# EAGLE board ARE_adaptadores_v101 (EAGLE 6.1), part 1 of 2
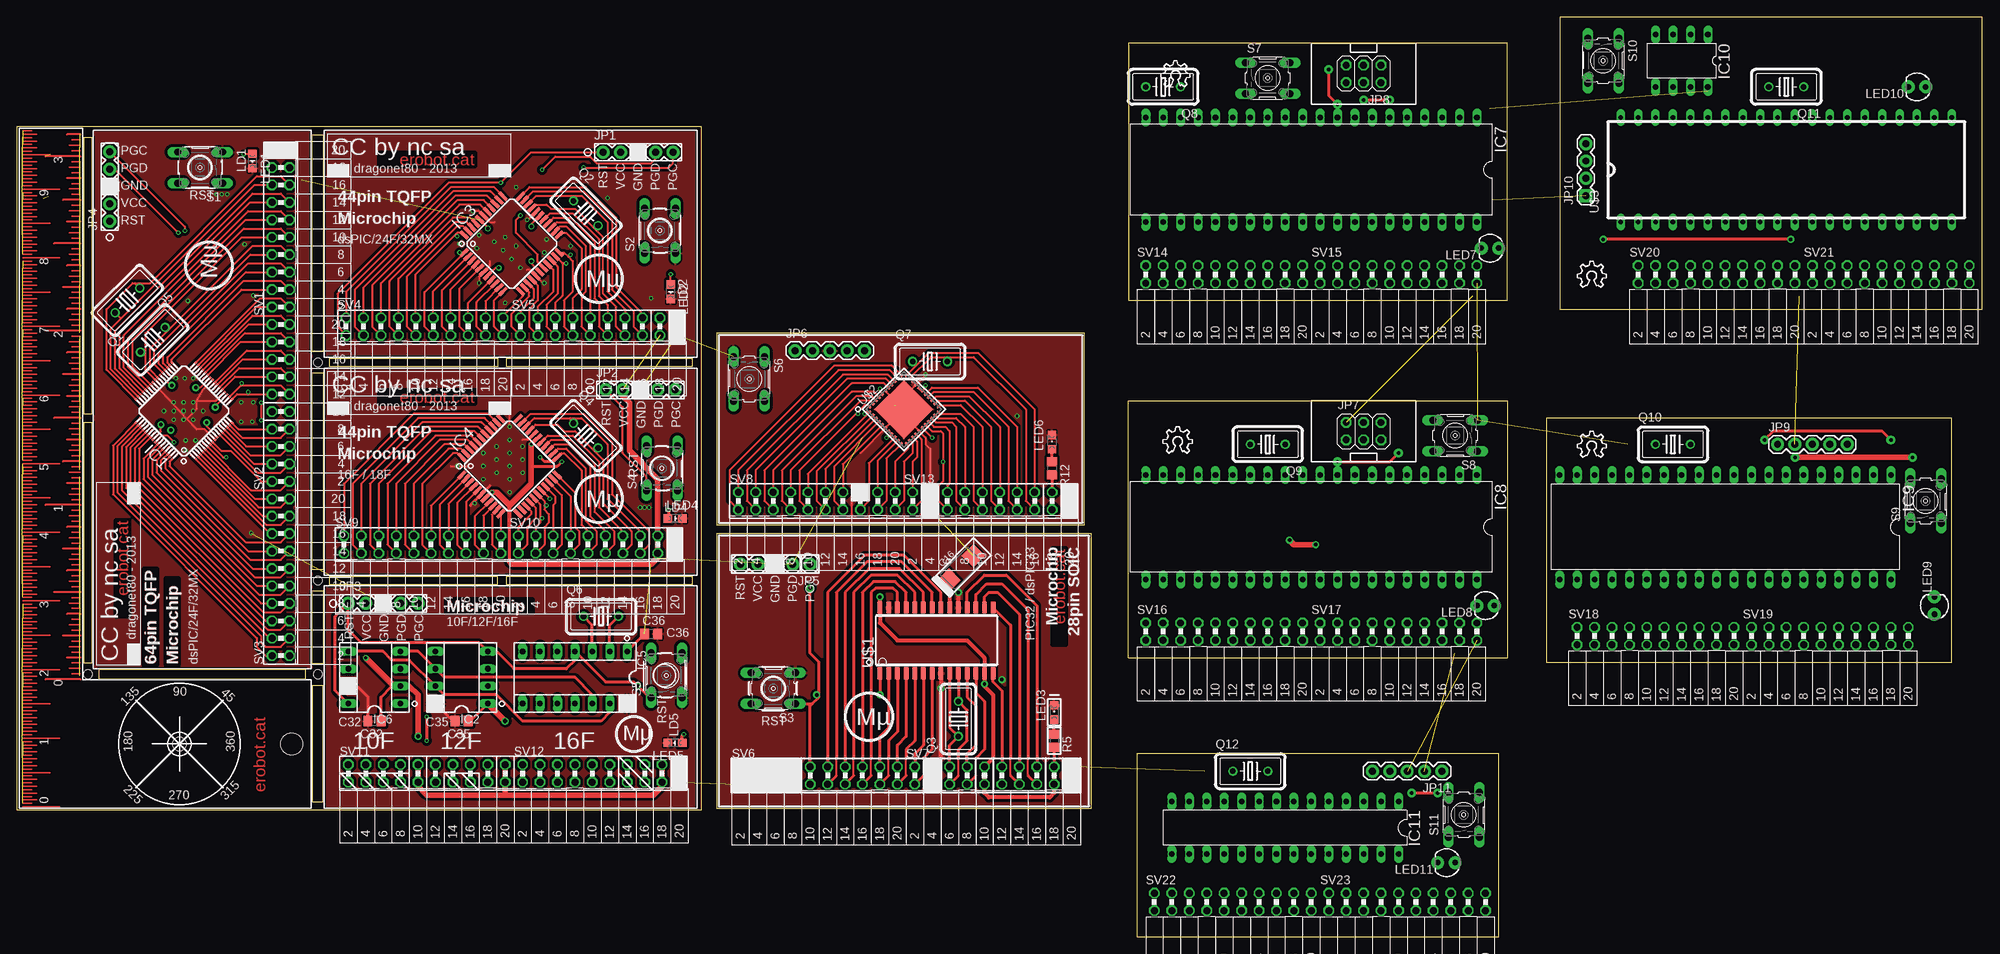
[diagram p11: board, top side]
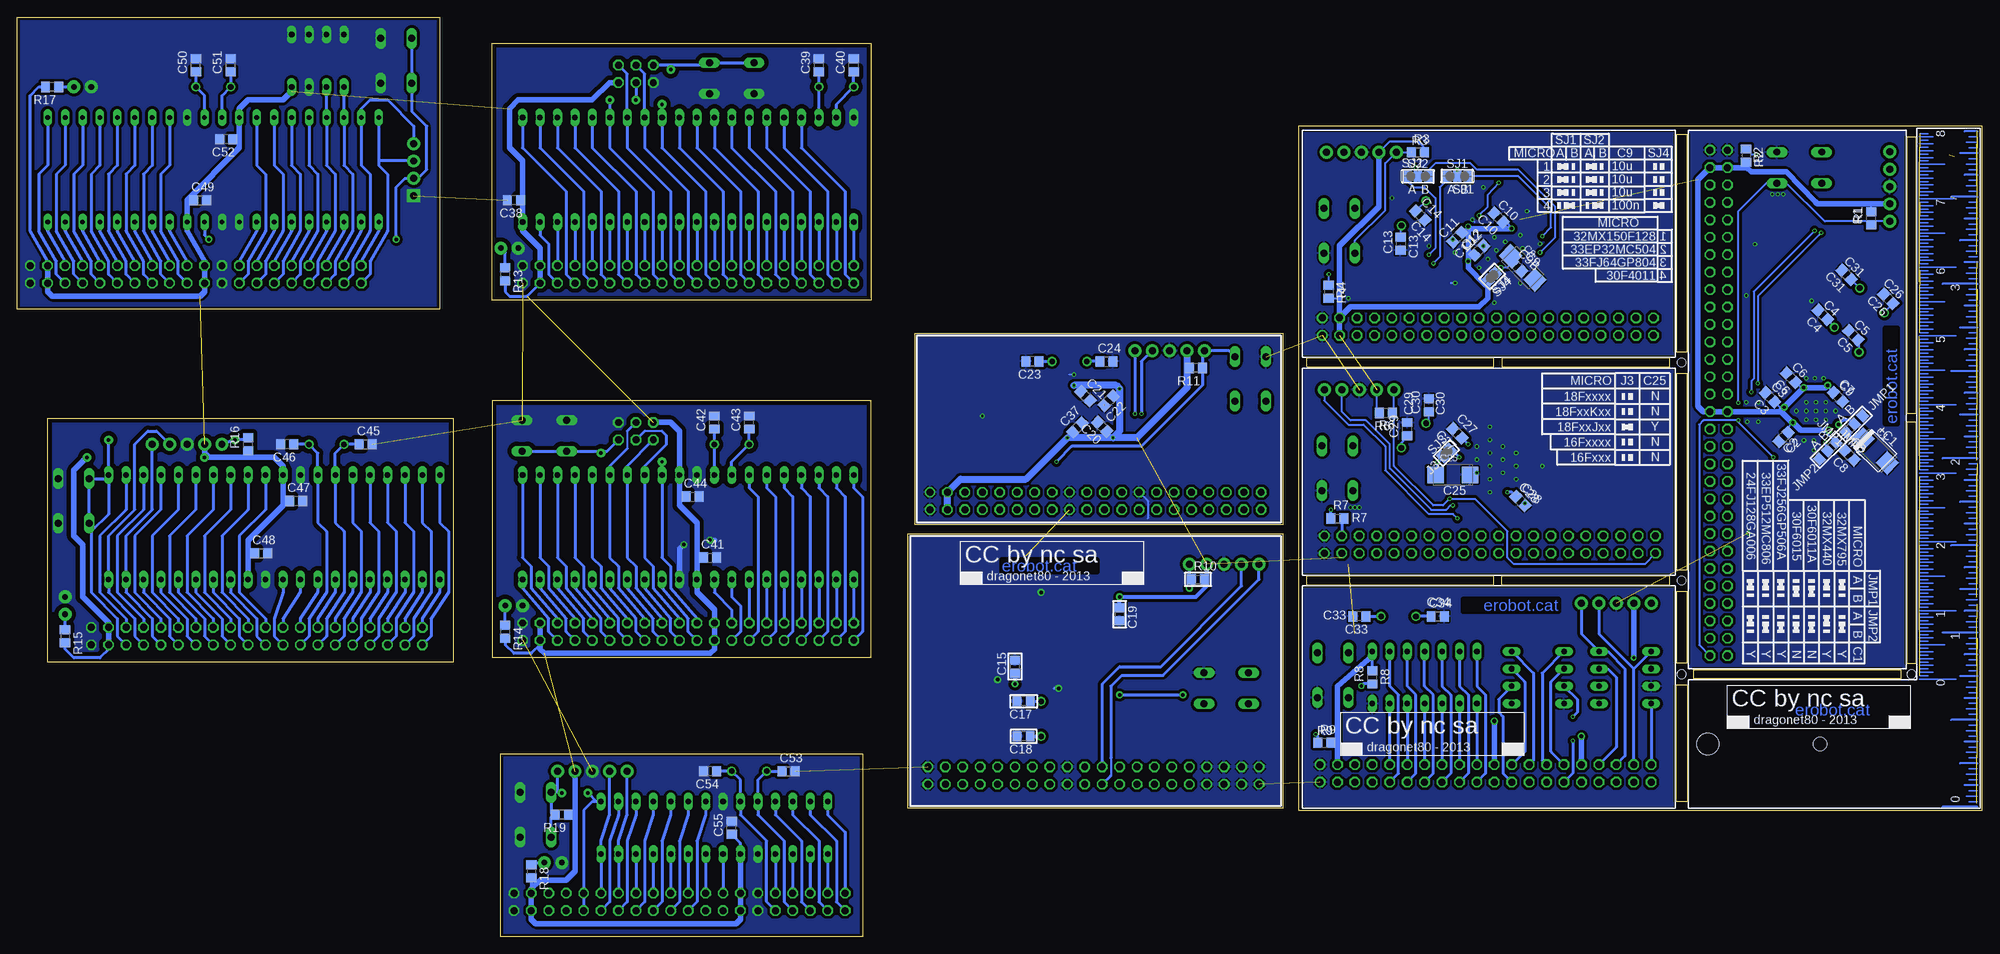
[diagram p12: board, bottom side, seen from below]

Size 286.38 x 133.98 mm. Coordinates in mm from the lower left corner, seen from the top.
Outline: 99.69,118.11 99.69,18.41 0,18.41 0,118.11 99.69,118.11
Outline: 9.68,116.52 9.68,76.2 10.95,76.2 10.95,116.52 9.68,116.52
Outline: 9.68,74.93 9.68,39.85 10.95,39.85 10.95,74.93 9.68,74.93
Outline: 11.91,37.62 42.07,37.62 42.07,38.89 11.91,38.89 11.91,37.62
Outline: 43.02,36.67 43.02,19.68 44.61,19.68 44.61,36.67 43.02,36.67
Outline: 43.02,39.85 43.02,50.32 44.61,50.32 44.61,39.85 43.02,39.85
Outline: 43.02,53.5 43.02,82.07 44.61,82.07 44.61,53.5 43.02,53.5
Outline: 43.02,85.25 43.02,116.84 44.61,116.84 44.61,85.25 43.02,85.25
Outline: 45.56,84.3 70.01,84.3 70.01,83.03 45.56,83.03 45.56,84.3
Outline: 71.28,84.3 98.42,84.3 98.42,83.03 71.28,83.03 71.28,84.3
Outline: 45.56,52.55 70.01,52.55 70.01,51.28 45.56,51.28 45.56,52.55
Outline: 71.28,52.55 98.42,52.55 98.42,51.28 71.28,51.28 71.28,52.55
Outline: 101.92,18.73 156.53,18.73 156.53,58.74 101.92,58.74 101.92,18.73
Outline: 101.92,60.01 155.57,60.01 155.57,87.95 101.92,87.95 101.92,60.01
Outline: 161.93,92.71 217.17,92.71 217.17,130.18 161.93,130.18 161.93,92.71
Outline: 161.93,40.64 217.17,40.64 217.17,78.1 161.93,78.1 161.93,40.64
Outline: 222.88,40 281.94,40 281.94,75.56 222.88,75.56 222.88,40
Outline: 224.79,91.44 286.38,91.44 286.38,133.98 224.79,133.98 224.79,91.44
Outline: 163.19,0 215.9,0 215.9,26.67 163.19,26.67 163.19,0
Copper layers (1*16): Top 0.035mm / dielectric 1.5mm / Bottom 0.035mm
Design rules: minimum track width 6mil, minimum drill 12mil, track to track 6mil, track to pad 6mil, pad to pad 6mil, via to via 6mil, smd to smd 0mil, copper to edge 10mil, drill to drill 10mil, minimum pad ring 10mil, minimum via ring 6mil, stop-mask expansion 2mil, vias tented up to drill 100mil, thermal gap 10mil
Holes 3.2 mm at 40.01,28.1
Holes 2 mm at 23.65,28.1
Holes 1.3 mm at 43.81,83.66 43.81,51.91 43.81,38.26 10.32,38.26

## Footprints (pad centres in the part's own frame; a part is rotated, then mirrored left to right if it is on the bottom)
SMC_C = smd 2.4 x 2.4: + -2.5,0; - 2.5,0
C0805 = smd 1.3 x 1.5: 1 -0.95,0; 2 0.95,0
TQFP64-10X10 = smd 1.2 x 0.3: 1 -5.7,3.75; 2 -5.7,3.25; 3 -5.7,2.75; 4 -5.7,2.25; 5 -5.7,1.75; 6 -5.7,1.25; 7 -5.7,0.75; 8 -5.7,0.25; 9 -5.7,-0.25; 10 -5.7,-0.75; 11 -5.7,-1.25; 12 -5.7,-1.75; 13 -5.7,-2.25; 14 -5.7,-2.75; 15 -5.7,-3.25; 16 -5.7,-3.75; 33 5.7,-3.75; 34 5.7,-3.25; 35 5.7,-2.75; 36 5.7,-2.25; 37 5.7,-1.75; 38 5.7,-1.25; 39 5.7,-0.75; 40 5.7,-0.25; 41 5.7,0.25; 42 5.7,0.75; 43 5.7,1.25; 44 5.7,1.75; 45 5.7,2.25; 46 5.7,2.75; 47 5.7,3.25; 48 5.7,3.75 | smd 0.3 x 1.2: 17 -3.75,-5.7; 18 -3.25,-5.7; 19 -2.75,-5.7; 20 -2.25,-5.7; 21 -1.75,-5.7; 22 -1.25,-5.7; 23 -0.75,-5.7; 24 -0.25,-5.7; 25 0.25,-5.7; 26 0.75,-5.7; 27 1.25,-5.7; 28 1.75,-5.7; 29 2.25,-5.7; 30 2.75,-5.7; 31 3.25,-5.7; 32 3.75,-5.7; 49 3.75,5.7; 50 3.25,5.7; 51 2.75,5.7; 52 2.25,5.7; 53 1.75,5.7; 54 1.25,5.7; 55 0.75,5.7; 56 0.25,5.7; 57 -0.25,5.7; 58 -0.75,5.7; 59 -1.25,5.7; 60 -1.75,5.7; 61 -2.25,5.7; 62 -2.75,5.7; 63 -3.25,5.7; 64 -3.75,5.7
SOCKET-08 = drill 0.813 long: 1 -3.81,-3.81; 2 -1.27,-3.81; 3 1.27,-3.81; 4 3.81,-3.81; 5 3.81,3.81; 6 1.27,3.81; 7 -1.27,3.81; 8 -3.81,3.81
TQFP44 = smd 1.5 x 0.5: 1 -5.8,4; 2 -5.8,3.2; 3 -5.8,2.4; 4 -5.8,1.6; 5 -5.8,0.8; 6 -5.8,0; 7 -5.8,-0.8; 8 -5.8,-1.6; 9 -5.8,-2.4; 10 -5.8,-3.2; 11 -5.8,-4; 23 5.8,-4; 24 5.8,-3.2; 25 5.8,-2.4; 26 5.8,-1.6; 27 5.8,-0.8; 28 5.8,0; 29 5.8,0.8; 30 5.8,1.6; 31 5.8,2.4; 32 5.8,3.2; 33 5.8,4 | smd 0.5 x 1.5: 12 -4,-5.8; 13 -3.2,-5.8; 14 -2.4,-5.8; 15 -1.6,-5.8; 16 -0.8,-5.8; 17 0,-5.8; 18 0.8,-5.8; 19 1.6,-5.8; 20 2.4,-5.8; 21 3.2,-5.8; 22 4,-5.8; 34 4,5.8; 35 3.2,5.8; 36 2.4,5.8; 37 1.6,5.8; 38 0.8,5.8; 39 0,5.8; 40 -0.8,5.8; 41 -1.6,5.8; 42 -2.4,5.8; 43 -3.2,5.8; 44 -4,5.8
SOCKET-14 = drill 0.813 long: 1 -7.62,-3.81; 2 -5.08,-3.81; 3 -2.54,-3.81; 4 0,-3.81; 5 2.54,-3.81; 6 5.08,-3.81; 7 7.62,-3.81; 8 7.62,3.81; 9 5.08,3.81; 10 2.54,3.81; 11 0,3.81; 12 -2.54,3.81; 13 -5.08,3.81; 14 -7.62,3.81
DIL40 = drill 0.813 long: 1 -24.13,-7.62; 2 -21.59,-7.62; 3 -19.05,-7.62; 4 -16.51,-7.62; 5 -13.97,-7.62; 6 -11.43,-7.62; 7 -8.89,-7.62; 8 -6.35,-7.62; 9 -3.81,-7.62; 10 -1.27,-7.62; 11 1.27,-7.62; 12 3.81,-7.62; 13 6.35,-7.62; 14 8.89,-7.62; 15 11.43,-7.62; 16 13.97,-7.62; 17 16.51,-7.62; 18 19.05,-7.62; 19 21.59,-7.62; 20 24.13,-7.62; 21 24.13,7.62; 22 21.59,7.62; 23 19.05,7.62; 24 16.51,7.62; 25 13.97,7.62; 26 11.43,7.62; 27 8.89,7.62; 28 6.35,7.62; 29 3.81,7.62; 30 1.27,7.62; 31 -1.27,7.62; 32 -3.81,7.62; 33 -6.35,7.62; 34 -8.89,7.62; 35 -11.43,7.62; 36 -13.97,7.62; 37 -16.51,7.62; 38 -19.05,7.62; 39 -21.59,7.62; 40 -24.13,7.62
DIL8 = drill 0.813 long: 1 -3.81,-3.81; 2 -1.27,-3.81; 3 1.27,-3.81; 4 3.81,-3.81; 5 3.81,3.81; 6 1.27,3.81; 7 -1.27,3.81; 8 -3.81,3.81
DIL28-3 = drill 0.813 long: 1 -16.51,-3.81; 2 -13.97,-3.81; 3 -11.43,-3.81; 4 -8.89,-3.81; 5 -6.35,-3.81; 6 -3.81,-3.81; 7 -1.27,-3.81; 8 1.27,-3.81; 9 3.81,-3.81; 10 6.35,-3.81; 11 8.89,-3.81; 12 11.43,-3.81; 13 13.97,-3.81; 14 16.51,-3.81; 15 16.51,3.81; 16 13.97,3.81; 17 11.43,3.81; 18 8.89,3.81; 19 6.35,3.81; 20 3.81,3.81; 21 1.27,3.81; 22 -1.27,3.81; 23 -3.81,3.81; 24 -6.35,3.81; 25 -8.89,3.81; 26 -11.43,3.81; 27 -13.97,3.81; 28 -16.51,3.81
A0R-JMP = smd 1.5 x 1.3: 1 0,1.7; 2 0,0; 3 0,-1.7
1X05 = drill 1.016 pad 1.88: 1 0,0; 2 2.54,0; 3 5.08,0; 4 7.62,0; 5 10.16,0
2X03 = drill 1.016 octagon: 1 -2.54,-1.27; 2 -2.54,1.27; 3 0,-1.27; 4 0,1.27; 5 2.54,-1.27; 6 2.54,1.27
1X04 = drill 1.016 pad 1.88 square: 1 0,0 | drill 1.016 pad 1.88: 2 2.54,0; 3 5.08,0; 4 7.62,0
CHIPLED_0805 = smd 1.2 x 1.2: A 0,-1.05; C 0,1.05
LED3MM = drill 0.813 pad 1.88: A -1.27,0; K 1.27,0
HC18U-V = drill 0.813: 1 -2.54,0; 2 2.54,0
R0805 = smd 1.3 x 1.5: 1 -0.95,0; 2 0.95,0
B3F-10XX = drill 1.016 long: 1 -3.251,2.261; 2 3.251,2.261; 3 -3.251,-2.261; 4 3.251,-2.261
SJ_2 = smd 1.168 x 1.6: 1 -1.524,0; 2 0,0; 3 1.524,0
SJ = smd 1.168 x 1.6: 1 -0.762,0; 2 0.762,0
FE10-2W = drill 1.016 octagon: 1 -11.43,1.27; 2 -11.43,-1.27; 3 -8.89,1.27; 4 -8.89,-1.27; 5 -6.35,1.27; 6 -6.35,-1.27; 7 -3.81,1.27; 8 -3.81,-1.27; 9 -1.27,1.27; 10 -1.27,-1.27; 11 1.27,1.27; 12 1.27,-1.27; 13 3.81,1.27; 14 3.81,-1.27; 15 6.35,1.27; 16 6.35,-1.27; 17 8.89,1.27; 18 8.89,-1.27; 19 11.43,1.27; 20 11.43,-1.27
SO28W = smd 0.65 x 1.7: 1 -7.62,-4.78; 2 -6.35,-4.78; 3 -5.08,-4.78; 4 -3.81,-4.78; 5 -2.54,-4.78; 6 -1.27,-4.78; 7 0,-4.78; 8 1.27,-4.78; 9 2.54,-4.78; 10 3.81,-4.78; 11 5.08,-4.78; 12 6.35,-4.78; 13 7.62,-4.78; 14 8.89,-4.78; 15 8.89,4.78; 16 7.62,4.78; 17 6.35,4.78; 18 5.08,4.78; 19 3.81,4.78; 20 2.54,4.78; 21 1.27,4.78; 22 0,4.78; 23 -1.27,4.78; 24 -2.54,4.78; 25 -3.81,4.78; 26 -5.08,4.78; 27 -6.35,4.78; 28 -7.62,4.78
QFN44ML8X8 = smd 0.45 x 0.33: 1 -3.788,3.25; 2 -3.788,2.6; 3 -3.788,1.95; 4 -3.788,1.3; 5 -3.788,0.65; 6 -3.788,0; 7 -3.788,-0.65; 8 -3.788,-1.3; 9 -3.788,-1.95; 10 -3.788,-2.6; 11 -3.788,-3.25; 23 3.788,-3.25; 24 3.788,-2.6; 25 3.788,-1.95; 26 3.788,-1.3; 27 3.788,-0.65; 28 3.788,0; 29 3.788,0.65; 30 3.788,1.3; 31 3.788,1.95; 32 3.788,2.6; 33 3.788,3.25 | smd 0.33 x 0.45: 12 -3.25,-3.788; 13 -2.6,-3.788; 14 -1.95,-3.788; 15 -1.3,-3.788; 16 -0.65,-3.788; 17 0,-3.788; 18 0.65,-3.788; 19 1.3,-3.788; 20 1.95,-3.788; 21 2.6,-3.788; 22 3.25,-3.788; 34 3.25,3.788; 35 2.6,3.788; 36 1.95,3.788; 37 1.3,3.788; 38 0.65,3.788; 39 0,3.788; 40 -0.65,3.788; 41 -1.3,3.788; 42 -1.95,3.788; 43 -2.6,3.788; 44 -3.25,3.788 | smd 6 x 6: EXP 0,0
P8X32A-D40 = drill 0.7 pad 1.27 long: 1 -7.62,23.495; 2 -7.62,20.955; 3 -7.62,18.415; 4 -7.62,15.875; 5 -7.62,13.335; 6 -7.62,10.795; 7 -7.62,8.255; 8 -7.62,5.715; 9 -7.62,3.175; 10 -7.62,0.635; 11 -7.62,-1.905; 12 -7.62,-4.445; 13 -7.62,-6.985; 14 -7.62,-9.525; 15 -7.62,-12.065; 16 -7.62,-14.605; 17 -7.62,-17.145; 18 -7.62,-19.685; 19 -7.62,-22.225; 20 -7.62,-24.765; 21 7.62,-24.765; 22 7.62,-22.225; 23 7.62,-19.685; 24 7.62,-17.145; 25 7.62,-14.605; 26 7.62,-12.065; 27 7.62,-9.525; 28 7.62,-6.985; 29 7.62,-4.445; 30 7.62,-1.905; 31 7.62,0.635; 32 7.62,3.175; 33 7.62,5.715; 34 7.62,8.255; 35 7.62,10.795; 36 7.62,13.335; 37 7.62,15.875; 38 7.62,18.415; 39 7.62,20.955; 40 7.62,23.495

## Placement (x,y rotation side)
C1  10uF  [SMC_C]  15.61,70.8 315 bottom
C2  100n  [C0805]  28.97,72.81 225 bottom
C3  100n  [C0805]  30.94,78.59 135 bottom
C4  18p  [C0805]  23.26,90.61 135 bottom
C5  18p  [C0805]  18.8,87.65 135 bottom
C6  100n  [C0805]  27.89,81.45 135 bottom
C7  100n  [C0805]  21.03,78.65 315 bottom
C8  100n  [C0805]  19.37,70.17 315 bottom
C9  10uF  [SMC_C]  66.99,97.47 315 bottom
C9B  100n  [C0805]  67.79,97.63 315 bottom
C10  100n  [C0805]  70.48,104.78 135 bottom
C11  100n  [C0805]  76.52,101.92 225 bottom
C12  100n  [C0805]  73.34,100.01 45 bottom
C13  18p  [C0805]  84.77,100.97 270 bottom
C14  18p  [C0805]  81.92,105.09 315 bottom
C15  100n  [C0805]  140.97,39.37 90 bottom
C16  10uF  [SMC_C]  137.57,53.75 45 top
C17  18p  [C0805]  139.7,34.29 180 bottom
C18  18p  [C0805]  139.7,29.21 180 bottom
C19  100n  [C0805]  125.73,46.99 270 bottom
C20  100n  [C0805]  128.27,74.3 135 bottom
C21  100n  [C0805]  130.72,78.78 315 bottom
C22  100n  [C0805]  127.32,78.1 225 bottom
C23  18p  [C0805]  138.43,83.82 180 bottom
C24  18p  [C0805]  127.64,83.82 0 bottom
C25  10uF  [SMC_C]  77.15,67.31 0 bottom
C26  18p  [C0805]  13.7,92.94 135 bottom
C27  100n  [C0805]  76.52,73.34 135 bottom
C28  100n  [C0805]  67.31,63.5 315 bottom
C29  18p  [C0805]  83.82,73.98 90 bottom
C30  18p  [C0805]  80.64,77.47 90 bottom
C31  18p  [C0805]  19.78,96.43 135 bottom
C32  100n  [C0805]  52.07,31.43 180 top
C33  18p  [C0805]  90.81,46.67 180 bottom
C34  18p  [C0805]  79.38,46.67 0 bottom
C35  100n  [C0805]  64.77,31.43 180 top
C36  100n  [C0805]  92.39,44.13 0 top
C37  100n  [C0805]  131.86,74.2 45 bottom
C38  100n  [C0805]  214,107.31 180 bottom
C39  15p  [C0805]  169.54,127 90 bottom
C40  15p  [C0805]  164.47,127 90 bottom
C41  100n  [C0805]  185.42,55.24 0 bottom
C42  15p  [C0805]  184.78,74.93 90 bottom
C43  15p  [C0805]  179.71,74.93 90 bottom
C44  100n  [C0805]  187.96,64.13 0 bottom
C45  15p  [C0805]  235.59,71.75 0 bottom
C46  15p  [C0805]  247.01,71.75 180 bottom
C47  100n  [C0805]  245.75,63.5 0 bottom
C48  100n  [C0805]  250.82,55.88 0 bottom
C49  100n  [C0805]  259.71,107.31 0 bottom
C50  15p  [C0805]  260.35,127 90 bottom
C51  15p  [C0805]  255.27,127 90 bottom
C52  100n  [C0805]  255.91,116.21 180 bottom
C53  15p  [C0805]  173.99,24.13 0 bottom
C54  15p  [C0805]  185.42,24.13 180 bottom
C55  100n  [C0805]  182.25,15.88 90 bottom
IC1  PIC32MX  [TQFP64-10X10]  24.31,76.61 135 top
IC2  12F  [SOCKET-08]  64.77,37.78 90 top
IC3  PIC24FJ32GA004  [TQFP44]  72.07,100.97 45 top
IC4  PIC16F1517/19PT  [TQFP44]  71.75,68.57 45 top
IC5  16F  [SOCKET-14]  81.28,37.78 180 top
IC6  10F  [SOCKET-08]  52.07,37.78 90 top
IC7  AT90S8515P  [DIL40]  188.59,111.76 180 top
IC8  AT90S8535P  [DIL40]  188.59,59.69 180 top
IC9  PIC16F877P  [DIL40]  248.92,59.69 180 top
IC10  24LC21AP  [DIL8]  242.57,127.63 180 top
IC11  PIC18F2480-I/SP  [DIL28-3]  184.78,15.88 180 top
JMP1  0R-JUMPA  [A0R-JMP]  18.64,74.71 135 bottom
JMP2  0R-JUMPA  [A0R-JMP]  22.54,70.8 315 bottom
JP1  [1X05]  85.41,114.3 0 top
JP2  [1X05]  85.72,79.69 0 top
JP3  [1X05]  48.26,48.58 0 top
JP4  [1X05]  13.51,104.23 90 top
JP5  [1X05]  115.57,54.29 180 top
JP6  [1X05]  113.35,85.41 0 top
JP7  [2X03]  196.22,73.66 0 top
JP8  [2X03]  196.22,125.73 180 top
JP9  [1X05]  256.54,71.75 0 top
JP10  [1X04]  228.6,107.95 90 top
JP11  [1X05]  207.65,24.13 180 top
LED1  [CHIPLED_0805]  34.29,113.03 180 top
LED2  [CHIPLED_0805]  95.25,93.98 180 top
LED3  [CHIPLED_0805]  151.13,32.7 0 top
LED4  [CHIPLED_0805]  95.89,60.96 270 top
LED5  [CHIPLED_0805]  95.89,28.26 90 top
LED6  [CHIPLED_0805]  150.81,72.07 0 top
LED7  [LED3MM]  214.63,100.33 180 top
LED8  [LED3MM]  214,48.26 180 top
LED9  [LED3MM]  279.4,48.26 90 top
LED10  [LED3MM]  276.86,123.82 180 top
LED11  [LED3MM]  208.28,10.79 180 top
LOGO1  OSHW_LOGO_8MILX0150-NT  [OSHW_8X150_NOTEXT]  167,70.48 0 top
LOGO2  OSHW_LOGO_8MILX0150-NT  [OSHW_8X150_NOTEXT]  166.69,123.82 0 top
LOGO3  OSHW_LOGO_8MILX0150-NT  [OSHW_8X150_NOTEXT]  227.33,94.62 0 top
LOGO4  OSHW_LOGO_8MILX0150-NT  [OSHW_8X150_NOTEXT]  227.33,69.85 0 top
Q1  [HC18U-V]  19.77,86.99 45 top
Q2  [HC18U-V]  82.87,105.41 315 top
Q3  [HC18U-V]  137.16,31.75 90 top
Q4  [HC18U-V]  82.87,73.03 315 top
Q5  [HC18U-V]  16.06,92.71 225 top
Q6  [HC18U-V]  85.09,46.67 0 top
Q7  [HC18U-V]  133.03,83.82 0 top
Q8  [HC18U-V]  167,123.82 180 top
Q9  [HC18U-V]  182.25,71.75 180 top
Q10  [HC18U-V]  241.3,71.75 0 top
Q11  [HC18U-V]  257.81,123.82 180 top
Q12  [HC18U-V]  179.71,24.13 0 top
R1  4K7  [R0805]  16.17,104.71 90 bottom
R2  1K  [R0805]  34.45,113.82 270 bottom
R3  4K7  [R0805]  82.23,114.3 0 bottom
R4  1K  [R0805]  95.25,93.98 270 bottom
R5  1K  [R0805]  151.13,28.57 270 top
R6  4K7  [R0805]  86.9,76.29 180 bottom
R7  1K  [R0805]  93.98,60.96 0 bottom
R8  4K7  [R0805]  88.9,37.78 90 bottom
R9  1K  [R0805]  95.89,28.26 0 bottom
R10  4K7  [R0805]  114.3,52.07 0 bottom
R11  4K7  [R0805]  114.62,82.87 180 bottom
R12  1K  [R0805]  150.81,68.26 270 top
R13  1K  [R0805]  215.26,96.52 270 bottom
R14  1K  [R0805]  215.26,44.45 270 bottom
R15  1K  [R0805]  279.4,43.81 270 bottom
R16  10K  [R0805]  252.73,71.75 90 bottom
R17  1K  [R0805]  281.31,123.82 180 bottom
R18  1K  [R0805]  211.46,9.52 270 bottom
R19  10K  [R0805]  207.01,17.78 180 bottom
S1  [B3F-10XX]  26.67,112.08 180 top
S2  [B3F-10XX]  93.66,102.87 90 top
S3  [B3F-10XX]  110.17,36.2 180 top
S4  [B3F-10XX]  93.98,68.26 90 top
S5  [B3F-10XX]  94.61,38.1 90 top
S6  [B3F-10XX]  106.68,81.28 270 top
S7  [B3F-10XX]  182.25,125.09 0 top
S8  [B3F-10XX]  209.55,73.03 180 top
S9  [B3F-10XX]  278.13,63.5 90 top
S10  [B3F-10XX]  231.14,127.63 270 top
S11  [B3F-10XX]  210.82,17.78 90 top
SJ1  [SJ_2]  76.52,110.81 180 bottom
SJ2  [SJ_2]  82.23,110.81 0 bottom
SJ3  [SJ]  78.11,70.48 45 bottom
SJ4  [SJ]  71.44,96.2 225 bottom
SV1  [FE10-2W]  38.42,103.19 90 top
SV2  [FE10-2W]  38.42,77.79 90 top
SV3  [FE10-2W]  38.42,52.39 90 top
SV4  [FE10-2W]  59.37,88.9 0 top
SV5  [FE10-2W]  84.77,88.9 0 top
SV6  [FE10-2W]  116.84,23.49 0 top
SV7  [FE10-2W]  142.24,23.49 0 top
SV8  [FE10-2W]  116.52,63.5 0 top
SV9  [FE10-2W]  59.05,57.15 0 top
SV10  [FE10-2W]  84.45,57.15 0 top
SV11  [FE10-2W]  59.69,23.81 0 top
SV12  [FE10-2W]  85.09,23.81 0 top
SV13  [FE10-2W]  141.92,63.5 0 top
SV14  [FE10-2W]  175.9,96.52 0 top
SV15  [FE10-2W]  201.29,96.52 0 top
SV16  [FE10-2W]  175.9,44.45 0 top
SV17  [FE10-2W]  201.29,44.45 0 top
SV18  [FE10-2W]  238.76,43.81 0 top
SV19  [FE10-2W]  264.16,43.81 0 top
SV20  [FE10-2W]  247.65,96.52 0 top
SV21  [FE10-2W]  273.05,96.52 0 top
SV22  [FE10-2W]  177.16,5.08 0 top
SV23  [FE10-2W]  202.56,5.08 0 top
U$1  SO28W  [SO28W]  133.35,43.18 0 top
U$2  DSPIC30F4011  [QFN44ML8X8]  129.22,76.84 45 top
U$3  P8X32A-D40  [P8X32A-D40]  257.18,111.76 90 top

## Tracks (layer width: path | path; a pad name or v marks a point on that pad's centre or on a via)
MCLR  (via drill 0.3 pad 0.61)
  Top 0.305: IC1.7 30,69.85 v30.48,69.85 | v35.56,77.79 v35.56,75.25
  Bottom 0.305: v30.48,69.85 35.56,74.93 v35.56,75.25 40.64,75.25 41.27,74.61 41.27,42.55 SV3.2 | v35.56,77.79 35.56,105.73 31.47,109.82 S1.1 28.54,109.82 22.95,104.23 16.03,104.23 | JP4.1 16.03,104.23 | R1.1 16.17,104.09 16.03,104.23
N$1  (via drill 0.3 pad 0.61)
  Top 0.305: LED1.A 34.19,113.98 v33.02,113.98
  Bottom 0.305: R2.1 33.66,113.98 v33.02,113.98
N$2  (via drill 0.3 pad 0.61)
  Top 0.305: LED2.A v95.25,96.52
  Bottom 0.305: R4.1 v95.25,96.52
N$3
  Top 0.406: R5.1 LED3.A
N$4  (via drill 0.3 pad 0.61)
  Top 0.406: v94.93,62.23 94.93,61.28 LED4.A
  Bottom 0.406: R7.1 v94.93,62.23
N$5
  Bottom 0.406: JMP1.1 19.05,72.71 17.52,72.71 C1.+
N$6
  Top 0.406: R12.1 LED6.A
N$7
  Bottom 0.406: R13.1 215.26,99.69 LED7.A
N$8  (via drill 0.3 pad 0.61)
  Top 0.406: LED5.A 96.94,29.31 v97.16,29.53
  Bottom 0.406: R9.1 96.83,29.21 v97.16,29.53
N$10
  Bottom 0.406: R14.1 LED8.A
N$11  (via drill 0.5 pad 0.61)
  Top 0.305: v70.17,97.47 69.71,97.47 IC3.7
  Bottom 0.305: C9.+ 68.46,99.24 C9B.1 69.29,97.47 v70.17,97.47
  Bottom 0.406: SJ4.1 v70.17,97.47
N$12
  Bottom 0.406: R15.1 LED9.A
N$13
  Bottom 0.406: R17.1 LED10.A
N$15
  Bottom 0.406: R18.1 211.13,10.79 LED11.A
N$29
  Top 0.61: C16.+ 135.89,51.89 U$1.20
N$109
  Bottom 0.305: 0.72,57.02 4.54,57.02
N$110
  Bottom 0.305: 0.72,69.72 5.8,69.72
N$111
  Bottom 0.305: 0.72,50.66 3.27,50.66
N$112
  Bottom 0.305: 0.72,63.37 3.27,63.37
N$113
  Bottom 0.305: 0.72,47.49 2.63,47.49
N$115
  Bottom 0.305: 0.72,53.84 2.63,53.84
N$116
  Bottom 0.305: 0.72,60.19 2.63,60.19
N$117
  Bottom 0.305: 0.72,66.54 2.63,66.54
N$118
  Bottom 0.254: 0.72,45.9 2.31,45.9
N$120
  Bottom 0.254: 0.72,49.08 2.31,49.08
N$122
  Bottom 0.254: 0.72,52.25 2.31,52.25
N$123
  Bottom 0.254: 0.72,55.43 2.31,55.43
N$124
  Bottom 0.305: 0.72,31.61 4.54,31.61
N$125
  Bottom 0.305: 0.72,44.31 5.8,44.31
N$127
  Bottom 0.305: 0.72,25.27 3.27,25.27
N$128
  Bottom 0.305: 0.72,37.97 3.27,37.97
N$129
  Bottom 0.254: 0.72,58.6 2.31,58.6
N$130
  Bottom 0.254: 0.72,61.78 2.31,61.78
N$131
  Bottom 0.254: 0.72,64.95 2.31,64.95
N$132
  Bottom 0.254: 0.72,68.13 2.31,68.13
N$134
  Bottom 0.203: 0.72,45.11 2,45.11
N$135
  Bottom 0.203: 0.72,46.7 2,46.7
N$136
  Bottom 0.203: 0.72,48.28 2,48.28
N$137
  Bottom 0.203: 0.72,49.87 2,49.87
N$139  (11 unrouted)
  Bottom 0.203: 0.72,51.46 2,51.46 | 0.72,53.05 2,53.05 | 0.72,54.63 2,54.63 | 0.72,56.22 2,56.22 | 0.72,57.81 2,57.81 | 0.72,59.4 2,59.4 | 0.72,60.98 2,60.98 | 0.72,62.57 2,62.57 | 0.72,64.16 2,64.16 | 0.72,65.75 2,65.75 | 0.72,67.33 2,67.33 | 0.72,68.92 2,68.92
N$140
  Bottom 0.305: 0.72,82.41 4.54,82.41
N$142
  Bottom 0.305: 0.72,18.91 5.8,18.91
N$143
  Bottom 0.305: 0.72,22.09 2.63,22.09
N$144
  Bottom 0.305: 0.72,28.44 2.63,28.44
N$145
  Bottom 0.305: 0.72,34.79 2.63,34.79
N$147
  Bottom 0.305: 0.72,41.14 2.63,41.14
N$148
  Bottom 0.305: 0.72,95.12 5.8,95.12
N$149
  Bottom 0.305: 0.72,76.06 3.27,76.06
N$150
  Bottom 0.254: 0.72,20.5 2.31,20.5
N$151
  Bottom 0.254: 0.72,23.68 2.31,23.68
N$152
  Bottom 0.254: 0.72,26.85 2.31,26.85
N$154
  Bottom 0.254: 0.72,30.03 2.31,30.03
N$155
  Bottom 0.254: 0.72,33.2 2.31,33.2
N$156
  Bottom 0.254: 0.72,36.38 2.31,36.38
N$157
  Bottom 0.254: 0.72,39.55 2.31,39.55
N$159
  Bottom 0.254: 0.72,42.73 2.31,42.73
N$160
  Bottom 0.203: 0.72,19.71 2,19.71
N$162
  Bottom 0.203: 0.72,21.3 2,21.3
N$163
  Bottom 0.203: 0.72,22.88 2,22.88
N$164
  Bottom 0.203: 0.72,24.47 2,24.47
N$165  (11 unrouted)
  Bottom 0.203: 0.72,26.06 2,26.06 | 0.72,27.65 2,27.65 | 0.72,29.23 2,29.23 | 0.72,30.82 2,30.82 | 0.72,32.41 2,32.41 | 0.72,34 2,34 | 0.72,35.58 2,35.58 | 0.72,37.17 2,37.17 | 0.72,38.76 2,38.76 | 0.72,40.35 2,40.35 | 0.72,41.93 2,41.93 | 0.72,43.52 2,43.52
N$167
  Bottom 0.305: 0.72,88.76 3.27,88.76
N$168
  Bottom 0.305: 0.72,72.89 2.63,72.89
N$169
  Bottom 0.305: 0.72,79.24 2.63,79.24
N$170
  Bottom 0.254: 9.18,48.53 7.18,48.53
N$171
  Bottom 0.254: 9.18,49.53 7.18,49.53
N$172
  Bottom 0.254: 9.18,50.53 7.18,50.53
N$173
  Bottom 0.254: 9.18,51.53 7.18,51.53
N$174
  Bottom 0.254: 9.18,52.53 5.5,52.53
N$175
  Bottom 0.254: 9.18,53.53 7.18,53.53
N$176
  Bottom 0.254: 9.18,54.53 7.18,54.53
N$177
  Bottom 0.254: 9.18,55.53 7.18,55.53
N$178
  Bottom 0.254: 9.18,56.53 7.18,56.53
N$179
  Bottom 0.305: 0.72,85.59 2.63,85.59
N$180
  Bottom 0.254: 9.18,57.53 3.81,57.53
N$181  (9 unrouted)
  Bottom 0.203: 9.15,48.03 7.9,48.03 | 9.15,49.03 7.9,49.03 | 9.15,50.03 7.9,50.03 | 9.15,51.03 7.9,51.03 | 9.15,52.03 7.9,52.03 | 9.15,53.03 7.9,53.03 | 9.15,54.03 7.9,54.03 | 9.15,55.03 7.9,55.03 | 9.15,56.03 7.9,56.03 | 9.15,57.03 7.9,57.03
N$182
  Bottom 0.254: 9.18,58.53 7.18,58.53
N$183
  Bottom 0.254: 9.18,59.53 7.18,59.53
N$185
  Bottom 0.254: 9.18,60.53 7.18,60.53
N$186
  Bottom 0.254: 9.18,61.53 7.18,61.53
N$187
  Bottom 0.254: 9.18,62.53 5.5,62.53
N$190  (9 unrouted)
  Bottom 0.203: 9.15,38.03 7.9,38.03 | 9.15,39.03 7.9,39.03 | 9.15,40.03 7.9,40.03 | 9.15,41.03 7.9,41.03 | 9.15,42.03 7.9,42.03 | 9.15,43.03 7.9,43.03 | 9.15,44.03 7.9,44.03 | 9.15,45.03 7.9,45.03 | 9.15,46.03 7.9,46.03 | 9.15,47.03 7.9,47.03
N$191
  Bottom 0.254: 9.18,63.53 7.18,63.53
N$192
  Bottom 0.254: 9.18,64.53 7.18,64.53
N$193
  Bottom 0.254: 9.18,65.53 7.18,65.53
N$194
  Bottom 0.254: 9.18,66.53 7.18,66.53
N$195
  Bottom 0.254: 9.18,67.53 3.81,67.53
N$196  (9 unrouted)
  Bottom 0.203: 9.15,58.03 7.9,58.03 | 9.15,59.03 7.9,59.03 | 9.15,60.03 7.9,60.03 | 9.15,61.03 7.9,61.03 | 9.15,62.03 7.9,62.03 | 9.15,63.03 7.9,63.03 | 9.15,64.03 7.9,64.03 | 9.15,65.03 7.9,65.03 | 9.15,66.03 7.9,66.03 | 9.15,67.03 7.9,67.03
N$197
  Bottom 0.254: 9.18,68.53 7.18,68.53
N$198
  Bottom 0.254: 9.18,69.53 7.18,69.53
N$199
  Bottom 0.254: 9.18,70.53 7.18,70.53
N$200
  Bottom 0.305: 0.72,91.94 2.63,91.94
N$201
  Bottom 0.254: 0.72,71.3 2.31,71.3
N$202
  Bottom 0.254: 0.72,74.48 2.31,74.48
N$203
  Bottom 0.254: 0.72,77.65 2.31,77.65
N$204
  Bottom 0.254: 0.72,80.83 2.31,80.83
N$205
  Bottom 0.254: 0.72,84 2.31,84
N$206
  Bottom 0.254: 0.72,87.18 2.31,87.18
N$207
  Bottom 0.254: 0.72,90.35 2.31,90.35
N$208
  Bottom 0.254: 0.72,93.53 2.31,93.53
N$209
  Bottom 0.203: 0.72,70.51 2,70.51
N$210
  Bottom 0.254: 9.18,37.53 3.81,37.53
N$211
  Bottom 0.254: 9.18,38.53 7.18,38.53
N$212
  Bottom 0.254: 9.18,39.53 7.18,39.53
N$213
  Bottom 0.254: 9.18,40.53 7.18,40.53
N$214
  Bottom 0.254: 9.18,41.53 7.18,41.53
N$215
  Bottom 0.254: 9.18,42.53 5.5,42.53
N$216
  Bottom 0.254: 9.18,43.53 7.18,43.53
N$217
  Bottom 0.254: 9.18,44.53 7.18,44.53
N$218
  Bottom 0.254: 9.18,45.53 7.18,45.53
N$219
  Bottom 0.254: 9.18,46.53 7.18,46.53
N$220
  Bottom 0.254: 9.18,47.53 3.81,47.53
N$221
  Bottom 0.254: 9.18,71.53 7.18,71.53
N$222
  Bottom 0.254: 9.18,72.53 5.5,72.53
N$223
  Bottom 0.254: 9.18,73.53 7.18,73.53
N$224
  Bottom 0.254: 9.18,74.53 7.18,74.53
N$225
  Bottom 0.254: 9.18,75.53 7.18,75.53
N$226
  Bottom 0.254: 9.18,76.53 7.18,76.53
N$227
  Bottom 0.254: 9.18,77.53 3.81,77.53
N$228  (9 unrouted)
  Bottom 0.203: 9.15,68.03 7.9,68.03 | 9.15,69.03 7.9,69.03 | 9.15,70.03 7.9,70.03 | 9.15,71.03 7.9,71.03 | 9.15,72.03 7.9,72.03 | 9.15,73.03 7.9,73.03 | 9.15,74.03 7.9,74.03 | 9.15,75.03 7.9,75.03 | 9.15,76.03 7.9,76.03 | 9.15,77.03 7.9,77.03
N$229
  Bottom 0.254: 9.18,78.53 7.18,78.53
N$230
  Bottom 0.254: 9.18,79.53 7.18,79.53
N$231
  Bottom 0.254: 9.18,80.53 7.18,80.53
N$232
  Bottom 0.254: 9.18,81.53 7.18,81.53
N$233
  Bottom 0.254: 9.18,82.53 5.5,82.53
N$234
  Bottom 0.254: 9.18,83.53 7.18,83.53
N$235
  Bottom 0.254: 9.18,84.53 7.18,84.53
N$236
  Bottom 0.254: 9.18,85.53 7.18,85.53
N$237
  Bottom 0.254: 9.18,86.53 7.18,86.53
N$238
  Bottom 0.254: 9.18,87.53 3.81,87.53
N$239  (9 unrouted)
  Bottom 0.203: 9.15,78.03 7.9,78.03 | 9.15,79.03 7.9,79.03 | 9.15,80.03 7.9,80.03 | 9.15,81.03 7.9,81.03 | 9.15,82.03 7.9,82.03 | 9.15,83.03 7.9,83.03 | 9.15,84.03 7.9,84.03 | 9.15,85.03 7.9,85.03 | 9.15,86.03 7.9,86.03 | 9.15,87.03 7.9,87.03
N$240
  Bottom 0.254: 9.18,88.53 7.18,88.53
N$241
  Bottom 0.254: 9.18,89.53 7.18,89.53
N$242
  Bottom 0.254: 9.18,90.53 7.18,90.53
N$243
  Bottom 0.254: 9.18,91.53 7.18,91.53
N$244
  Bottom 0.254: 9.18,92.53 5.5,92.53
N$245
  Bottom 0.254: 9.18,93.53 7.18,93.53
N$246
  Bottom 0.254: 9.18,94.53 7.18,94.53
N$247
  Bottom 0.254: 9.18,95.53 7.18,95.53
N$248
  Bottom 0.254: 9.18,96.53 7.18,96.53
N$249
  Bottom 0.254: 9.18,97.53 3.81,97.53
N$250  (9 unrouted)
  Bottom 0.203: 9.15,88.03 7.9,88.03 | 9.15,89.03 7.9,89.03 | 9.15,90.03 7.9,90.03 | 9.15,91.03 7.9,91.03 | 9.15,92.03 7.9,92.03 | 9.15,93.03 7.9,93.03 | 9.15,94.03 7.9,94.03 | 9.15,95.03 7.9,95.03 | 9.15,96.03 7.9,96.03 | 9.15,97.03 7.9,97.03
N$251
  Bottom 0.254: 9.18,98.53 7.18,98.53
N$252
  Bottom 0.254: 9.18,99.53 7.18,99.53
N$253
  Bottom 0.254: 9.18,100.53 7.18,100.53
N$254
  Bottom 0.254: 9.18,101.53 7.18,101.53
N$255
  Bottom 0.254: 9.18,102.53 5.5,102.53
N$256
  Bottom 0.254: 9.18,103.53 7.18,103.53
N$257
  Bottom 0.254: 9.18,104.53 7.18,104.53
N$258
  Bottom 0.254: 9.18,105.53 7.18,105.53
N$259
  Bottom 0.254: 9.18,106.53 7.18,106.53
N$260  (1 unrouted)
  Bottom 0.254: 9.18,107.53 3.81,107.53
  Bottom 0.305: 0.72,107.81 4.54,107.81
N$261  (9 unrouted)
  Bottom 0.203: 9.15,98.03 7.9,98.03 | 9.15,99.03 7.9,99.03 | 9.15,100.03 7.9,100.03 | 9.15,101.03 7.9,101.03 | 9.15,102.03 7.9,102.03 | 9.15,103.03 7.9,103.03 | 9.15,104.03 7.9,104.03 | 9.15,105.03 7.9,105.03 | 9.15,106.03 7.9,106.03 | 9.15,107.03 7.9,107.03
N$262
  Bottom 0.254: 9.18,108.53 7.18,108.53
N$263
  Bottom 0.254: 9.18,109.53 7.18,109.53
N$264
  Bottom 0.254: 9.18,110.53 7.18,110.53
N$265
  Bottom 0.254: 9.18,111.53 7.18,111.53
N$266
  Bottom 0.203: 0.72,72.1 2,72.1
N$267
  Bottom 0.203: 0.72,73.68 2,73.68
N$268
  Bottom 0.203: 0.72,75.27 2,75.27
N$269  (11 unrouted)
  Bottom 0.203: 0.72,76.86 2,76.86 | 0.72,78.45 2,78.45 | 0.72,80.03 2,80.03 | 0.72,81.62 2,81.62 | 0.72,83.21 2,83.21 | 0.72,84.8 2,84.8 | 0.72,86.38 2,86.38 | 0.72,87.97 2,87.97 | 0.72,89.56 2,89.56 | 0.72,91.15 2,91.15 | 0.72,92.73 2,92.73 | 0.72,94.32 2,94.32
N$272
  Bottom 0.305: 0.72,101.47 3.27,101.47
N$273
  Bottom 0.254: 9.18,112.53 5.5,112.53
N$274
  Bottom 0.305: 0.72,114.16 3.27,114.16
N$275
  Bottom 0.305: 0.72,98.29 2.63,98.29
N$276
  Bottom 0.305: 0.72,104.64 2.63,104.64
N$277
  Bottom 0.305: 0.72,110.99 2.63,110.99
N$278
  Bottom 0.254: 9.18,113.53 7.18,113.53
N$279
  Bottom 0.305: 0.72,117.34 2.63,117.34
N$280
  Bottom 0.254: 0.72,96.7 2.31,96.7
N$281
  Bottom 0.254: 9.18,114.53 7.18,114.53
N$282
  Bottom 0.254: 0.72,99.88 2.31,99.88
N$283
  Bottom 0.254: 0.72,103.05 2.31,103.05
N$284
  Bottom 0.254: 0.72,106.23 2.31,106.23
N$285
  Bottom 0.254: 0.72,109.4 2.31,109.4
N$286
  Bottom 0.254: 9.18,115.53 7.18,115.53
N$287
  Bottom 0.254: 0.72,112.58 2.31,112.58
N$288
  Bottom 0.254: 0.72,115.75 2.31,115.75
N$290
  Bottom 0.203: 0.72,95.91 2,95.91
N$291
  Bottom 0.203: 0.72,97.5 2,97.5
N$292
  Bottom 0.203: 0.72,99.08 2,99.08
N$293
  Bottom 0.254: 9.18,116.53 7.18,116.53
N$294
  Bottom 0.203: 0.72,100.67 2,100.67
N$295  (9 unrouted)
  Bottom 0.203: 0.72,102.26 2,102.26 | 0.72,103.85 2,103.85 | 0.72,105.43 2,105.43 | 0.72,107.02 2,107.02 | 0.72,108.61 2,108.61 | 0.72,110.2 2,110.2 | 0.72,111.78 2,111.78 | 0.72,113.37 2,113.37 | 0.72,114.96 2,114.96 | 0.72,116.55 2,116.55
N$297  (9 unrouted)
  Bottom 0.203: 9.15,108.03 7.9,108.03 | 9.15,109.03 7.9,109.03 | 9.15,110.03 7.9,110.03 | 9.15,111.03 7.9,111.03 | 9.15,112.03 7.9,112.03 | 9.15,113.03 7.9,113.03 | 9.15,114.03 7.9,114.03 | 9.15,115.03 7.9,115.03 | 9.15,116.03 7.9,116.03 | 9.15,117.03 7.9,117.03
N$298
  Top 0.254: 0.82,18.93 6.18,18.93
N$299
  Top 0.254: 0.82,19.93 2.82,19.93
N$300
  Top 0.254: 0.82,20.93 2.82,20.93
N$301
  Top 0.254: 0.82,21.93 2.82,21.93
N$302
  Top 0.254: 0.82,22.93 2.82,22.93
N$303
  Top 0.254: 0.82,23.93 4.82,23.93
N$304
  Top 0.254: 0.82,24.93 2.82,24.93
N$305
  Top 0.254: 0.82,25.93 2.82,25.93
N$306
  Top 0.254: 0.82,26.93 2.82,26.93
N$307
  Top 0.254: 0.82,27.93 2.82,27.93
N$308
  Top 0.254: 0.82,28.93 6.18,28.93
N$309  (9 unrouted)
  Top 0.203: 0.85,19.43 2.1,19.43 | 0.85,20.43 2.1,20.43 | 0.85,21.43 2.1,21.43 | 0.85,22.43 2.1,22.43 | 0.85,23.43 2.1,23.43 | 0.85,24.43 2.1,24.43 | 0.85,25.43 2.1,25.43 | 0.85,26.43 2.1,26.43 | 0.85,27.43 2.1,27.43 | 0.85,28.43 2.1,28.43
N$310
  Top 0.254: 0.82,29.93 2.82,29.93
N$311
  Top 0.254: 0.82,30.93 2.82,30.93
N$312
  Top 0.254: 0.82,31.93 2.82,31.93
N$313
  Top 0.254: 0.82,32.94 2.82,32.94
N$314
  Top 0.254: 0.82,33.94 4.82,33.94
N$315
  Top 0.254: 0.82,34.94 2.82,34.94
N$316
  Top 0.254: 0.82,35.94 2.82,35.94
N$317
  Top 0.254: 0.82,36.94 2.82,36.94
N$318
  Top 0.254: 0.82,37.94 2.82,37.94
N$319
  Top 0.254: 0.82,38.94 6.18,38.94
N$320  (9 unrouted)
  Top 0.203: 0.85,29.43 2.1,29.43 | 0.85,30.43 2.1,30.43 | 0.85,31.43 2.1,31.43 | 0.85,32.44 2.1,32.44 | 0.85,33.44 2.1,33.44 | 0.85,34.44 2.1,34.44 | 0.85,35.44 2.1,35.44 | 0.85,36.44 2.1,36.44 | 0.85,37.44 2.1,37.44 | 0.85,38.44 2.1,38.44
N$321
  Top 0.254: 0.82,39.94 2.82,39.94
N$322
  Top 0.254: 0.82,40.94 2.82,40.94
N$323
  Top 0.254: 0.82,41.94 2.82,41.94
N$324
  Top 0.254: 0.82,42.94 2.82,42.94
N$325
  Top 0.254: 0.82,43.94 4.82,43.94
N$326
  Top 0.254: 0.82,44.94 2.82,44.94
N$327
  Top 0.254: 0.82,45.94 2.82,45.94
N$328
  Top 0.254: 0.82,46.94 2.82,46.94
N$329
  Top 0.254: 0.82,47.94 2.82,47.94
N$330
  Top 0.254: 0.82,48.94 6.18,48.94
N$331  (9 unrouted)
  Top 0.203: 0.85,39.44 2.1,39.44 | 0.85,40.44 2.1,40.44 | 0.85,41.44 2.1,41.44 | 0.85,42.44 2.1,42.44 | 0.85,43.44 2.1,43.44 | 0.85,44.44 2.1,44.44 | 0.85,45.44 2.1,45.44 | 0.85,46.44 2.1,46.44 | 0.85,47.44 2.1,47.44 | 0.85,48.44 2.1,48.44
N$332
  Top 0.254: 0.82,49.94 2.82,49.94
N$333
  Top 0.254: 0.82,50.94 2.82,50.94
N$334
  Top 0.254: 0.82,51.94 2.82,51.94
N$335
  Top 0.254: 0.82,52.94 2.82,52.94
N$336
  Top 0.254: 0.82,53.94 4.82,53.94
N$337
  Top 0.254: 0.82,54.94 2.82,54.94
N$338
  Top 0.254: 0.82,55.94 2.82,55.94
N$339
  Top 0.254: 0.82,56.94 2.82,56.94
N$340
  Top 0.254: 0.82,57.94 2.82,57.94
N$341
  Top 0.254: 0.82,58.94 6.18,58.94
N$342  (9 unrouted)
  Top 0.203: 0.85,49.44 2.1,49.44 | 0.85,50.44 2.1,50.44 | 0.85,51.44 2.1,51.44 | 0.85,52.44 2.1,52.44 | 0.85,53.44 2.1,53.44 | 0.85,54.44 2.1,54.44 | 0.85,55.44 2.1,55.44 | 0.85,56.44 2.1,56.44 | 0.85,57.44 2.1,57.44 | 0.85,58.44 2.1,58.44
N$343
  Top 0.254: 0.82,59.94 2.82,59.94
N$344
  Top 0.254: 0.82,60.94 2.82,60.94
N$345
  Top 0.254: 0.82,61.94 2.82,61.94
N$346
  Top 0.254: 0.82,62.94 2.82,62.94
N$347
  Top 0.254: 0.82,63.94 4.82,63.94
N$348
  Top 0.254: 0.82,64.94 2.82,64.94
N$349
  Top 0.254: 0.82,65.94 2.82,65.94
N$350
  Top 0.254: 0.82,66.94 2.82,66.94
N$351
  Top 0.254: 0.82,67.94 2.82,67.94
N$352
  Top 0.254: 0.82,68.94 6.18,68.94
N$353  (9 unrouted)
  Top 0.203: 0.85,59.44 2.1,59.44 | 0.85,60.44 2.1,60.44 | 0.85,61.44 2.1,61.44 | 0.85,62.44 2.1,62.44 | 0.85,63.44 2.1,63.44 | 0.85,64.44 2.1,64.44 | 0.85,65.44 2.1,65.44 | 0.85,66.44 2.1,66.44 | 0.85,67.44 2.1,67.44 | 0.85,68.44 2.1,68.44
N$354
  Top 0.254: 0.82,69.94 2.82,69.94
N$355
  Top 0.254: 0.82,70.94 2.82,70.94
N$356
  Top 0.254: 0.82,71.94 2.82,71.94
N$357
  Top 0.254: 0.82,72.94 2.82,72.94
N$358
  Top 0.254: 0.82,73.94 4.82,73.94
N$359
  Top 0.254: 0.82,74.94 2.82,74.94
N$360
  Top 0.254: 0.82,75.94 2.82,75.94
N$361
  Top 0.254: 0.82,76.94 2.82,76.94
N$362
  Top 0.254: 0.82,77.94 2.82,77.94
N$363
  Top 0.254: 0.82,78.94 6.18,78.94
N$364  (9 unrouted)
  Top 0.203: 0.85,69.44 2.1,69.44 | 0.85,70.44 2.1,70.44 | 0.85,71.44 2.1,71.44 | 0.85,72.44 2.1,72.44 | 0.85,73.44 2.1,73.44 | 0.85,74.44 2.1,74.44 | 0.85,75.44 2.1,75.44 | 0.85,76.44 2.1,76.44 | 0.85,77.44 2.1,77.44 | 0.85,78.44 2.1,78.44
N$365
  Top 0.254: 0.82,79.94 2.82,79.94
N$366
  Top 0.254: 0.82,80.94 2.82,80.94
N$367
  Top 0.254: 0.82,81.94 2.82,81.94
N$368
  Top 0.254: 0.82,82.94 2.82,82.94
N$369
  Top 0.254: 0.82,83.94 4.82,83.94
N$370
  Top 0.254: 0.82,84.94 2.82,84.94
N$371
  Top 0.254: 0.82,85.94 2.82,85.94
N$372
  Top 0.254: 0.82,86.94 2.82,86.94
N$373
  Top 0.254: 0.82,87.94 2.82,87.94
N$374
  Top 0.254: 0.82,88.94 6.18,88.94
N$375  (9 unrouted)
  Top 0.203: 0.85,79.44 2.1,79.44 | 0.85,80.44 2.1,80.44 | 0.85,81.44 2.1,81.44 | 0.85,82.44 2.1,82.44 | 0.85,83.44 2.1,83.44 | 0.85,84.44 2.1,84.44 | 0.85,85.44 2.1,85.44 | 0.85,86.44 2.1,86.44 | 0.85,87.44 2.1,87.44 | 0.85,88.44 2.1,88.44
N$376
  Top 0.254: 0.82,89.94 2.82,89.94
N$377
  Top 0.254: 0.82,90.94 2.82,90.94
N$378
  Top 0.254: 0.82,91.94 2.82,91.94
N$379
  Top 0.254: 0.82,92.94 2.82,92.94
N$380
  Top 0.254: 0.82,93.94 4.82,93.94
N$381
  Top 0.254: 0.82,94.94 2.82,94.94
N$382
  Top 0.254: 0.82,95.94 2.82,95.94
N$383
  Top 0.254: 0.82,96.94 2.82,96.94
N$384
  Top 0.254: 0.82,97.94 2.82,97.94
N$385
  Top 0.254: 0.82,98.94 6.18,98.94
N$386  (9 unrouted)
  Top 0.203: 0.85,89.44 2.1,89.44 | 0.85,90.44 2.1,90.44 | 0.85,91.44 2.1,91.44 | 0.85,92.44 2.1,92.44 | 0.85,93.44 2.1,93.44 | 0.85,94.44 2.1,94.44 | 0.85,95.44 2.1,95.44 | 0.85,96.44 2.1,96.44 | 0.85,97.44 2.1,97.44 | 0.85,98.44 2.1,98.44
N$387
  Top 0.254: 0.82,99.94 2.82,99.94
N$388
  Top 0.254: 0.82,100.94 2.82,100.94
N$389
  Top 0.254: 0.82,101.94 2.82,101.94
N$390
  Top 0.254: 0.82,102.94 2.82,102.94
N$391
  Top 0.254: 0.82,103.94 4.82,103.94
N$392
  Top 0.254: 0.82,104.94 2.82,104.94
N$393
  Top 0.254: 0.82,105.94 2.82,105.94
N$394
  Top 0.254: 0.82,106.94 2.82,106.94
N$395
  Top 0.254: 0.82,107.94 2.82,107.94
N$396
  Top 0.254: 0.82,108.94 6.18,108.94
N$397  (9 unrouted)
  Top 0.203: 0.85,99.44 2.1,99.44 | 0.85,100.44 2.1,100.44 | 0.85,101.44 2.1,101.44 | 0.85,102.44 2.1,102.44 | 0.85,103.44 2.1,103.44 | 0.85,104.44 2.1,104.44 | 0.85,105.44 2.1,105.44 | 0.85,106.44 2.1,106.44 | 0.85,107.44 2.1,107.44 | 0.85,108.44 2.1,108.44
N$398
  Top 0.254: 0.82,109.94 2.82,109.94
N$399
  Top 0.254: 0.82,110.94 2.82,110.94
N$400
  Top 0.254: 0.82,111.94 2.82,111.94
N$401
  Top 0.254: 0.82,112.94 2.82,112.94
N$402  (1 unrouted)
  Top 0.254: 0.82,113.94 4.82,113.94
  Top 0.305: 9.2,113.72 4.12,113.72
N$403
  Top 0.254: 0.82,114.94 2.82,114.94
N$404
  Top 0.254: 0.82,115.94 2.82,115.94
N$405
  Top 0.254: 0.82,116.94 2.82,116.94
N$408  (8 unrouted)
  Top 0.203: 0.85,109.44 2.1,109.44 | 0.85,110.44 2.1,110.44 | 0.85,111.44 2.1,111.44 | 0.85,112.44 2.1,112.44 | 0.85,113.44 2.1,113.44 | 0.85,114.44 2.1,114.44 | 0.85,115.44 2.1,115.44 | 0.85,116.44 2.1,116.44 | 0.85,117.44 2.1,117.44
N$409
  Top 0.305: 9.2,50.22 5.38,50.22
N$410
  Top 0.305: 9.2,62.91 4.12,62.91
N$411
  Top 0.305: 9.2,43.86 6.66,43.86
N$412
  Top 0.305: 9.2,56.56 6.66,56.56
N$413
  Top 0.305: 9.2,37.52 4.12,37.52
N$414
  Top 0.305: 9.2,40.69 7.29,40.69
N$415
  Top 0.305: 9.2,47.04 7.29,47.04
N$416
  Top 0.305: 9.2,53.39 7.29,53.39
N$417
  Top 0.305: 9.2,59.74 7.29,59.74
N$418
  Top 0.254: 9.2,39.1 7.61,39.1
N$419
  Top 0.254: 9.2,42.28 7.61,42.28
N$420
  Top 0.254: 9.2,45.45 7.61,45.45
N$421
  Top 0.254: 9.2,48.63 7.61,48.63
N$422
  Top 0.254: 9.2,51.8 7.61,51.8
N$423
  Top 0.254: 9.2,54.98 7.61,54.98
N$424
  Top 0.254: 9.2,58.15 7.61,58.15
N$425
  Top 0.254: 9.2,61.33 7.61,61.33
N$426
  Top 0.203: 9.2,38.31 7.92,38.31
N$427
  Top 0.203: 9.2,39.9 7.92,39.9
N$428
  Top 0.203: 9.2,41.48 7.92,41.48
N$429
  Top 0.203: 9.2,43.07 7.92,43.07
N$430  (11 unrouted)
  Top 0.203: 9.2,44.66 7.92,44.66 | 9.2,46.25 7.92,46.25 | 9.2,47.83 7.92,47.83 | 9.2,49.42 7.92,49.42 | 9.2,51.01 7.92,51.01 | 9.2,52.6 7.92,52.6 | 9.2,54.18 7.92,54.18 | 9.2,55.77 7.92,55.77 | 9.2,57.36 7.92,57.36 | 9.2,58.95 7.92,58.95 | 9.2,60.53 7.92,60.53 | 9.2,62.12 7.92,62.12
N$431
  Top 0.305: 9.2,75.62 5.38,75.62
N$432
  Top 0.305: 9.2,88.31 4.12,88.31
N$433
  Top 0.305: 9.2,69.27 6.66,69.27
N$434
  Top 0.305: 9.2,81.97 6.66,81.97
N$435
  Top 0.305: 9.2,66.09 7.29,66.09
N$436
  Top 0.305: 9.2,72.44 7.29,72.44
N$437
  Top 0.305: 9.2,78.79 7.29,78.79
N$438
  Top 0.305: 9.2,85.14 7.29,85.14
N$439
  Top 0.254: 9.2,64.5 7.61,64.5
N$440
  Top 0.254: 9.2,67.68 7.61,67.68
N$441
  Top 0.254: 9.2,70.85 7.61,70.85
N$442
  Top 0.254: 9.2,74.03 7.61,74.03
N$443
  Top 0.254: 9.2,77.2 7.61,77.2
N$444
  Top 0.254: 9.2,80.38 7.61,80.38
N$445
  Top 0.254: 9.2,83.55 7.61,83.55
N$446
  Top 0.254: 9.2,86.73 7.61,86.73
N$447
  Top 0.203: 9.2,63.71 7.92,63.71
N$448
  Top 0.203: 9.2,65.3 7.92,65.3
N$449
  Top 0.203: 9.2,66.88 7.92,66.88
N$450
  Top 0.203: 9.2,68.47 7.92,68.47
N$451  (11 unrouted)
  Top 0.203: 9.2,70.06 7.92,70.06 | 9.2,71.65 7.92,71.65 | 9.2,73.23 7.92,73.23 | 9.2,74.82 7.92,74.82 | 9.2,76.41 7.92,76.41 | 9.2,78 7.92,78 | 9.2,79.58 7.92,79.58 | 9.2,81.17 7.92,81.17 | 9.2,82.76 7.92,82.76 | 9.2,84.35 7.92,84.35 | 9.2,85.93 7.92,85.93 | 9.2,87.52 7.92,87.52
N$452
  Top 0.305: 9.2,101.01 5.38,101.01
N$454
  Top 0.305: 9.2,94.66 6.66,94.66
N$455
  Top 0.305: 9.2,107.37 6.66,107.37
N$456
  Top 0.305: 9.2,91.49 7.29,91.49
N$457
  Top 0.305: 9.2,97.84 7.29,97.84
N$458
  Top 0.305: 9.2,104.19 7.29,104.19
N$459
  Top 0.305: 9.2,110.54 7.29,110.54
N$460
  Top 0.254: 9.2,89.9 7.61,89.9
N$461
  Top 0.254: 9.2,93.08 7.61,93.08
N$462
  Top 0.254: 9.2,96.25 7.61,96.25
N$463
  Top 0.254: 9.2,99.43 7.61,99.43
N$464
  Top 0.254: 9.2,102.6 7.61,102.6
N$465
  Top 0.254: 9.2,105.78 7.61,105.78
N$466
  Top 0.254: 9.2,108.95 7.61,108.95
N$467
  Top 0.254: 9.2,112.13 7.61,112.13
N$468
  Top 0.203: 9.2,89.11 7.92,89.11
N$469
  Top 0.203: 9.2,90.7 7.92,90.7
N$470
  Top 0.203: 9.2,92.28 7.92,92.28
N$471
  Top 0.203: 9.2,93.87 7.92,93.87
N$472  (11 unrouted)
  Top 0.203: 9.2,95.46 7.92,95.46 | 9.2,97.05 7.92,97.05 | 9.2,98.63 7.92,98.63 | 9.2,100.22 7.92,100.22 | 9.2,101.81 7.92,101.81 | 9.2,103.4 7.92,103.4 | 9.2,104.98 7.92,104.98 | 9.2,106.57 7.92,106.57 | 9.2,108.16 7.92,108.16 | 9.2,109.75 7.92,109.75 | 9.2,111.33 7.92,111.33 | 9.2,112.92 7.92,112.92
N$477
  Top 0.305: 9.2,116.89 7.29,116.89
N$481
  Top 0.254: 9.2,115.3 7.61,115.3
N$489
  Top 0.203: 9.2,114.51 7.92,114.51
N$490
  Top 0.203: 9.2,116.1 7.92,116.1
P1
  Top 0.305: IC1.1 36.87,58.74 SV3.15
P1OSC1
  Top 0.305: IC1.39 19.37,82.61 19.37,85.72 21.91,88.26 | 21.91,88.26 34.29,100.65 38.42,100.65 SV1.8 | Q1.2 21.91,88.44 21.91,88.26
  Bottom 0.305: C4.1 21.56,88.91 Q1.2
P1OSC2
  Top 0.305: IC1.40 18.73,82.53 18.73,85.09 | 18.73,85.09 18.73,87.95 32.7,101.92 SV1.9 | Q1.1 18.07,85.09 18.73,85.09
  Bottom 0.305: C5.1 17.97,86.82 Q1.1
P1SOSCI
  Top 0.305: IC1.47 13.65,82.67 13.65,88.58 15.08,90.01 | 15.08,90.01 34.61,109.54 SV1.15 | Q5.2 15.08,90.1 15.08,90.01
  Bottom 0.305: C26.1 Q5.2
P1SOSCO
  Top 0.305: IC1.48 13.02,82.59 13.02,91.44 16.83,95.25 17.14,95.25 | 17.14,95.25 19.37,95.25 34.92,110.81 38.42,110.81 SV1.16 | Q5.1 17.14,95.22 17.14,95.25
  Bottom 0.305: C31.1 Q5.1
P2
  Top 0.305: IC1.2 36.31,60.01 38.42,60.01 SV3.18
P2GC  (via drill 0.3 pad 0.61)
  Top 0.305: v82.55,112.08 94.93,112.08 95.57,112.71 JP1.5
  Bottom 0.305: SJ2.2 82.23,111.76 v82.55,112.08
P2GD  (via drill 0.3 pad 0.61)
  Top 0.305: v76.52,111.76 78.42,113.66 83.5,113.66 84.45,112.71 92.39,112.71 93.03,113.35 JP1.4
  Bottom 0.305: SJ1.2 v76.52,111.76
P2MCLR  (via drill 0.3 pad 0.61)  (1 unrouted)
  Top 0.305: IC3.18 75.88,98.29 75.88,99.38 72.71,102.55 72.71,104.46 v73.34,105.09 | SV4.2 46.67,88.9 46.67,93.66 62.87,109.85 v70.48,109.85 74.93,114.3 JP1.1
  Bottom 0.305: v73.34,105.09 72.07,106.36 72.07,108.11 v70.48,109.85 | S2.1 91.4,101.48 87,105.89 87,112.71 JP1.1 R3.1
P2OSC1
  Top 0.305: IC3.30 75.53,106.68 77.15,106.68 77.79,106.04 81.28,106.04 84.45,102.87 | 84.45,102.87 85.41,101.92 85.41,93.66 87.31,91.76 87.31,88.9 SV5.14 | Q2.2 84.45,103.41 84.45,102.87
  Bottom 0.305: Q2.2 84.77,103.5 C13.1
P2OSC2
  Top 0.305: IC3.31 75.66,107.95 80.96,107.95 | 80.96,107.95 82.23,107.95 86.04,104.14 86.04,93.98 88.58,91.44 SV5.13 | Q2.1 80.96,107.31 80.96,107.95
  Bottom 0.305: Q2.1 81.32,106.96 C14.1
P3
  Top 0.305: IC1.3 35.75,61.28 SV3.17
P3GC
  Top 0.305: 129.54,23.49 129.54,26.04
  Top 0.406: U$1.5 130.81,28.57 129.54,27.3 129.54,26.04 | SV6.20 129.54,23.49
  Bottom 0.305: 127,26.04 127,23.49
  Bottom 0.406: JP5.5 105.41,52.07 119.38,38.1 125.41,38.1 127,36.51 127,26.04 | 127,23.49 SV6.20
P3GD
  Top 0.406: U$1.4 129.54,29.21 128.27,27.94 SV6.19
  Bottom 0.406: JP5.4 107.95,51.12 119.7,39.37 125.73,39.37 128.27,36.83 SV6.19
P3MCLR  (via drill 0.5 pad 1.02)
  Top 0.406: U$1.1 v125.73,35.24 | SV6.10 SV6.9 115.57,33.66 115.85,33.93 | S3.1 115.85,33.93 | 115.85,33.93 116.84,34.92 116.84,35.24 | 116.84,35.24 116.84,40 115.57,41.27 v115.57,50.8 | v116.52,35.24 116.84,35.24
  Bottom 0.406: v125.73,35.24 v116.52,35.24 | v115.57,50.8 115.57,52.07 | 115.57,52.07 JP5.1 | R10.1 115.57,52.07
P3OSC1
  Top 0.406: U$1.9 135.89,30.48 Q3.1 135.89,27.94 SV7.5
  Bottom 0.406: C18.1 Q3.1
P3OSC2
  Top 0.305: 137.16,23.49 137.16,26.04
  Top 0.406: U$1.10 Q3.2 138.43,33.02 138.43,28.57 137.16,27.3 137.16,26.04 | SV7.6 137.16,23.49
  Bottom 0.406: C17.1 Q3.2
P4
  Top 0.305: IC1.4 35.19,62.55 38.42,62.55 SV3.20
P4GC  (via drill 0.3 pad 0.61)
  Top 0.305: IC4.16 76.2,62.99 76.2,60.96 | 76.2,60.96 76.2,60.32 75.56,59.69 SV10.3 | v76.52,60.96 76.2,60.96
  Bottom 0.305: JP2.5 95.89,78.1 92.39,74.61 90.17,74.61 87,71.44 87,67.94 80.64,61.59 77.15,61.59 v76.52,60.96
P4GD  (via drill 0.3 pad 0.61)
  Top 0.305: IC4.17 76.83,63.48 76.83,62.85 | 76.83,62.85 76.83,62.23 77.47,61.59 77.47,60.32 76.83,59.69 76.83,57.15 SV10.4 | v77.15,62.85 76.83,62.85
  Bottom 0.305: JP2.4 93.34,76.52 92.08,75.25 89.85,75.25 86.36,71.75 86.36,68.26 80.31,62.21 78.11,62.23 77.49,62.85 v77.15,62.85
P4MCLR  (via drill 0.3 pad 0.61)
  Top 0.305: IC4.18 v77.63,63.82 | S4.1 91.72,67.03 88.27,70.48 88.27,77.15 JP2.1
  Bottom 0.305: 85.72,76.2 85.72,68.58 80.01,62.87 78.58,62.87 v77.63,63.82 73.98,63.82 69.22,59.05 69.22,55.24 68.26,54.29 49.21,54.29 SV9.2 | R6.1 85.95,75.97 85.72,76.2 | 85.72,76.2 JP2.1
P4OSC1
  Top 0.305: IC4.30 75.53,74.61 78.74,74.61 79.69,73.66 81.28,73.66 83.82,71.12 | SV10.14 89.53,57.15 89.53,59.05 85.41,63.18 85.41,69.53 83.82,71.12 | Q4.2 84.56,71.12 83.82,71.12
  Bottom 0.305: C29.1 84.66,71.96 Q4.2
P4OSC2
  Top 0.305: IC4.31 75.35,75.56 80.64,75.56 | 80.64,75.56 82.23,75.56 86.04,71.75 86.04,63.82 90.81,59.05 SV10.15 | Q4.1 80.64,75.25 80.64,75.56
  Bottom 0.305: Q4.1 80.64,75.25 C30.1
P5
  Top 0.305: IC1.5 34.62,63.82 SV3.19
P5GC
  Top 0.406: IC6.4 58.42,41.59 IC2.6 62.23,37.78 81.28,37.78 83.82,35.24 IC5.12
  Bottom 0.406: SV11.5 52.07,26.35 52.07,39.05 54.61,41.59 IC6.4 58.42,44.13 JP3.5 | IC2.6 62.87,37.15 62.87,26.99 SV11.11 | IC5.12 SV12.9
P5GD  (via drill 0.3 pad 0.61)
  Top 0.406: v59.69,32.07 v59.69,28.57 | IC5.13 86.36,32.7 85.09,31.43 73.66,31.43 69.85,35.24 62.23,35.24 IC2.7 57.15,40.32 54.61,40.32 53.34,41.59 IC6.5
  Bottom 0.406: SV11.3 50.8,39.05 | 50.8,39.05 IC6.5 | IC2.7 59.05,34.61 59.05,32.7 v59.69,32.07 | v59.69,28.57 59.69,23.81 SV11.12 | SV12.11 IC5.13 | JP3.4 55.88,44.13 50.8,39.05
P5MCLR  (via drill 0.5 pad 0.61)
  Top 0.406: IC6.8 46.35,35.88 46.35,46.67 JP3.1 48.26,44.77 50.16,42.86 67.31,42.86 IC2.4 69.85,41.59 72.39,39.05 80.01,39.05 81.28,40.32 IC5.4 85.72,37.15 89.85,37.15 v90.49,36.51 92.08,34.92 92.04,34.89 92.08,34.85 S5.1
  Bottom 0.406: IC6.8 SV11.1 | IC2.4 65.41,38.42 65.41,25.72 SV11.15 | SV12.8 80.01,23.81 80.01,35.24 81.28,36.51 IC5.4 | R8.1 90.17,36.83 v90.49,36.51
P5OSC1
  Top 0.406: IC5.2 86.36,45.4 Q6.2
  Bottom 0.406: C33.1 Q6.2 | SV12.12 85.09,23.81 85.09,35.24 86.36,36.51 IC5.2
P5OSC2
  Top 0.406: IC5.3 83.82,45.4 Q6.1
  Bottom 0.406: C34.1 Q6.1 | SV12.10 82.55,23.81 82.55,35.24 83.82,36.51 IC5.3
P6
  Top 0.305: IC1.6 34.06,65.09 38.42,65.09 SV2.2
P6GC  (via drill 0.3 pad 0.61)
  Top 0.305: SV8.9 115.25,67.46 U$2.1 123.76,76.45 v123.51,76.2
  Bottom 0.406: JP6.5 v123.51,76.2
P6GD  (via drill 0.3 pad 0.61)
  Top 0.305: U$2.44 123.99,77.47 123.51,77.47 122.24,76.2 | 122.24,76.2 113.98,67.94 113.98,63.5 SV8.10 | v122.56,76.2 122.24,76.2
  Bottom 0.406: JP6.4 122.56,83.82 v122.56,76.2
P6MCLR  (via drill 0.3 pad 0.61)
  Top 0.305: SV13.6 134.3,63.5 134.3,65.72 134.94,66.36 v134.94,69.22 134.94,73.34 134.62,73.66 133.32,73.66 U$2.18
  Bottom 0.305: JP6.1 113.67,85.09 | R11.1
  Bottom 0.406: 113.67,85.09 R11.1 113.67,80.33 122.56,71.44 132.72,71.44 v134.94,69.22 | S6.1 109.82,85.41 JP6.1
P6OSC1
  Top 0.305: U$2.32 133.17,84.46 135.57,84.46 | 135.57,84.46 139.38,84.46 147,76.84 147,63.5 SV13.16 | Q7.2 135.57,84.46
  Bottom 0.406: C23.1 Q7.2
P6OSC2
  Top 0.305: U$2.33 131.05,83.26 | 131.05,83.26 132.88,85.09 140.02,85.09 148.27,76.84 SV13.15 | Q7.1 131.05,83.26 | 131.05,83.26
  Bottom 0.406: C24.1 Q7.1
P7MCLR  (via drill 0.5 pad 1.27)
  Top 0.406: v192.41,121.28 191.13,122.56 v191.13,126.37
  Bottom 0.406: S7.1 S7.2 185.85,127 191.13,127 | SV14.18 186.06,96.52 186.06,108.59 192.41,114.94 IC7.9 v192.41,121.28 | 191.13,127 JP8.5 | v191.13,126.37 191.13,127
P7OSC1
  Bottom 0.406: C40.1 Q8.2 167,121.28 IC7.19
P7OSC2
  Bottom 0.406: C39.1 Q8.1 IC7.18
P8
  Top 0.305: IC1.8 29.76,70.8 31.11,70.8 35.56,66.36 SV2.1
P8MCLR  (via drill 0.5 pad 1.27)
  Top 0.406: v192.41,69.22 200.03,69.22 v201.29,70.48
  Bottom 0.406: 201.29,70.76 S8.2 S8.1 | 201.29,70.76 200.38,70.76 JP7.5 | v192.41,69.22 IC8.9 192.41,55.24 191.13,53.98 191.13,50.8 187.32,46.36 SV16.19 | 201.29,70.76 v201.29,70.48
P8OSC1
  Bottom 0.406: C43.1 Q9.2 182.25,69.22 IC8.13
P8OSC2
  Bottom 0.406: IC8.12 Q9.1 C42.1
P9GC
  Bottom 0.406: SV19.12 266.7,43.81 266.7,46.36 270.51,50.16 IC9.39 270.51,58.42 266.7,62.23 JP9.5
P9GD
  Bottom 0.406: SV19.14 269.24,43.81 269.24,46.36 273.05,50.16 IC9.40 273.05,58.42 269.24,62.23 269.24,71.75 267.33,73.66 266.06,73.66 JP9.4
P9MCLR  (via drill 0.5 pad 1.27)
  Top 0.406: v273.05,72.39 271.78,73.66 255.91,73.66 v254.63,72.39
  Bottom 0.406: IC9.1 273.05,61.59 275.59,59.05 275.59,50.16 271.78,46.36 271.78,43.81 SV19.16 | S9.1 S9.2 273.61,66.75 IC9.1 | IC9.1 v273.05,72.39 | JP9.1 v254.63,72.39 253.05,72.39 R16.2
P9OSC1
  Bottom 0.406: SV18.16 243.84,43.81 243.84,46.36 241.3,50.16 241.3,59.05 242.57,60.32 IC9.13 242.57,70.48 Q10.2 C46.1
P9OSC2
  Bottom 0.406: SV18.14 241.3,43.81 241.3,46.36 238.76,50.16 238.76,59.05 240.03,60.32 IC9.14 240.03,70.48 Q10.1 C45.1
P10MCLR  (via drill 0.5 pad 1.02)
  Top 0.406: v258.44,101.6 v231.14,101.6
  Bottom 0.406: S10.3 S10.4 228.88,120.29 226.69,118.11 226.69,111.76 227.97,110.49 JP10.2 229.87,110.49 231.14,109.22 v231.14,101.6 | U$3.11 259.08,102.23 v258.44,101.6
P10OSC1
  Bottom 0.406: U$3.30 259.08,122.56 Q11.1 C50.1
P10OSC2
  Bottom 0.406: U$3.31 256.54,122.56 Q11.2 C51.1
P10RX
  Bottom 0.406: U$3.40 233.68,113.03 | 233.68,113.03 233.68,112.4 232.41,111.12 232.41,102.87 234.95,98.43 234.95,96.52 SV20.2 | JP10.3 233.68,113.03
P10SCL
  Bottom 0.406: SV20.8 242.57,96.52 242.57,98.43 240.03,102.87 240.03,111.12 241.3,112.4 U$3.37 IC10.6
P10SDA
  Bottom 0.406: SV20.6 240.03,96.52 240.03,98.43 237.49,102.87 237.49,111.12 238.76,112.4 U$3.38 IC10.5
P10TX
  Bottom 0.406: SV20.4 237.49,96.52 237.49,98.43 234.95,102.87 234.95,111.12 236.22,112.4 U$3.39 236.22,120.65 234.95,121.92 232.41,121.92 228.6,118.11 JP10.4
P11
  Top 0.305: IC1.11 35.05,67.63 38.42,67.63 SV2.4
P11GC
  Bottom 0.406: JP11.5 197.49,17.78 198.75,13.97 IC11.27 SV23.7
P11GD
  Bottom 0.406: JP11.4 200.03,17.78 201.29,13.97 IC11.28 SV23.9
P11MCLR  (via drill 0.5 pad 1.27)
  Top 0.406: v203.2,20.95 v207.01,20.95
  Bottom 0.406: SV23.12 SV23.11 203.84,18.41 202.56,19.68 IC11.1 201.93,19.68 v203.2,20.95 | S11.1 208.56,17.42 208.28,17.78 | S11.2 208.56,18.14 208.28,17.78 | R19.2 208.28,17.78 | S11.2 207.65,21.31 JP11.1 | v207.01,20.95 208.2,21.03 S11.2
P11OSC1
  Bottom 0.406: SV22.10 177.16,5.08 177.16,13.97 180.97,17.78 IC11.9 180.97,22.86 Q12.2 C54.1
P11OSC2
  Bottom 0.406: SV22.8 174.62,5.08 174.62,13.97 178.44,17.78 IC11.10 178.44,22.86 Q12.1 C53.1
P12
  Top 0.305: IC1.12 34.49,68.9 SV2.3
P13
  Top 0.305: IC1.13 33.93,70.17 38.42,70.17 SV2.6
P14
  Top 0.305: IC1.14 33.37,71.44 SV2.5
P15
  Top 0.305: IC1.15 32.8,72.71 38.42,72.71 SV2.8
P16
  Top 0.305: IC1.16 32.24,73.98 SV2.7
P21
  Top 0.305: IC1.21 31.77,81.6 SV2.13
P22
  Top 0.305: IC1.22 32.34,82.87 38.42,82.87 SV2.14
P23
  Top 0.305: IC1.23 32.9,84.14 SV2.15
P24
  Top 0.305: IC1.24 33.46,85.41 38.42,85.41 SV2.16
P27
  Top 0.305: IC1.27 32.61,86.68 SV2.17
P28
  Top 0.305: IC1.28 33.17,87.95 38.42,87.95 SV2.18
P29
  Top 0.305: IC1.29 33.74,89.22 SV2.19
P30
  Top 0.305: IC1.30 34.3,90.49 38.42,90.49 SV2.20
P31
  Top 0.305: IC1.31 34.86,91.76 SV1.1
P32
  Top 0.305: IC1.32 35.43,93.03 38.42,93.03 SV1.2
P33
  Top 0.305: IC1.33 22.54,83.68 22.54,84.14 32.7,94.3 SV1.3
P34
  Top 0.305: IC1.34 21.91,83.6 21.91,84.46 33.02,95.57 38.42,95.57 SV1.4
P35
  Top 0.305: IC1.35 21.27,83.53 21.27,84.77 33.34,96.84 SV1.5
P36
  Top 0.305: IC1.36 20.64,83.46 20.64,85.09 33.66,98.11 38.42,98.11 SV1.6
P37
  Top 0.305: IC1.37 20,83.39 20,85.41 33.97,99.38 SV1.7
P42
  Top 0.305: IC1.42 16.83,83.03 16.83,87 33.02,103.19 38.42,103.19 SV1.10
P43
  Top 0.305: IC1.43 16.19,82.95 16.19,87.31 33.34,104.46 SV1.11
P44
  Top 0.305: IC1.44 15.56,82.88 15.56,87.63 33.66,105.73 38.42,105.73 SV1.12
P45
  Top 0.305: IC1.45 14.92,82.81 14.92,87.95 33.97,107 SV1.13
P46
  Top 0.305: IC1.46 14.29,82.74 14.29,88.26 34.29,108.27 38.42,108.27 SV1.14
P49
  Top 0.305: IC1.49 13.97,71.57 13.97,64.45 34.92,43.5 34.92,42.23 36.2,40.96 SV3.1
P50
  Top 0.305: IC1.50 14.61,71.5 14.61,64.77 35.56,43.81 35.56,42.86 36.2,42.23 38.42,42.23 SV3.4
P51
  Top 0.305: IC1.51 15.24,71.43 15.24,65.09 36.83,43.5 SV3.3
P52
  Top 0.305: IC1.52 15.88,71.36 15.88,65.41 36.51,44.77 38.42,44.77 SV3.6
P53
  Top 0.305: IC1.53 16.51,71.28 16.51,65.72 36.2,46.04 SV3.5
P54
  Top 0.305: IC1.54 17.14,71.21 17.14,66.04 35.88,47.31 38.42,47.31 SV3.8
P55
  Top 0.305: IC1.55 17.78,71.14 17.78,66.36 35.56,48.58 SV3.7
P58
  Top 0.305: IC1.58 18.41,69.65 18.41,66.67 35.24,49.85 38.42,49.85 SV3.10
P59
  Top 0.305: IC1.59 19.05,69.58 19.05,66.99 34.92,51.12 SV3.9
P60
  Top 0.305: IC1.60 19.68,69.51 19.68,67.31 34.61,52.39 38.42,52.39 SV3.12
P61
  Top 0.305: IC1.61 20.32,69.44 20.32,67.63 34.29,53.66 SV3.11
P62
  Top 0.305: IC1.62 20.95,69.37 20.95,67.94 33.97,54.93 38.42,54.93 SV3.14
P63
  Top 0.305: IC1.63 21.59,69.29 21.59,68.26 33.66,56.2 SV3.13
P64
  Top 0.305: IC1.64 22.23,69.22 22.23,68.58 33.34,57.47 38.42,57.47 SV3.16
P201
  Top 0.305: IC3.34 69.47,109.22 63.18,109.22 47.94,93.98 SV4.1
P203
  Top 0.305: IC3.36 68.48,107.95 63.82,107.95 50.48,94.62 SV4.3
P204
  Top 0.305: IC3.35 68.98,108.59 63.5,108.59 49.21,94.3 49.21,88.9 SV4.4
P205
  Top 0.305: IC3.38 67.49,106.68 64.45,106.68 53.02,95.25 SV4.5
P206
  Top 0.305: IC3.37 67.98,107.31 64.14,107.31 51.75,94.93 51.75,88.9 SV4.6
P207
  Top 0.305: IC3.42 65.5,104.14 63.82,104.14 55.56,95.88 SV4.7
P208
  Top 0.305: IC3.41 66,104.78 63.5,104.78 54.29,95.57 54.29,88.9 SV4.8
P209  (via drill 0.3 pad 0.61)
  Top 0.305: IC3.44 64.83,102.55 64.14,102.55 | 64.14,102.55 58.1,96.52 SV4.9 | v64.14,102.08 64.14,102.55
  Bottom 0.305: v64.14,102.08 62.87,103.35 62.87,106.04 67.63,110.81 SJ1.1
P210
  Top 0.305: IC3.43 65.01,103.5 64.14,103.5 56.83,96.2 56.83,88.9 SV4.10
P211
  Top 0.305: SV4.11 60.64,94.06 IC3.2
P212  (via drill 0.3 pad 0.61)
  Top 0.305: v64.45,99.69 IC3.1 59.37,93.92 59.37,88.9 SV4.12
  Bottom 0.305: v64.45,99.69 62.23,101.92 62.23,106.36 67.63,111.76 73.66,111.76 74.61,112.71 79.69,112.71 80.64,111.76 80.64,110.87 SJ2.3
P213
  Top 0.305: SV4.13 63.18,94.34 IC3.4
P214
  Top 0.305: SV4.14 61.91,88.9 61.91,94.2 IC3.3
P215
  Top 0.305: SV4.15 65.72,92.35 IC3.8
P216
  Top 0.305: SV4.16 64.45,88.9 64.45,94.48 IC3.5
P217
  Top 0.305: IC3.10 68.26,92.63 SV4.17
P218
  Top 0.305: SV4.18 66.99,88.9 66.99,92.49 IC3.9
P219
  Top 0.305: IC3.12 73.66,93.72 73.66,93.34 70.8,90.49 SV4.19
P220
  Top 0.305: 70.48,93.72 IC3.11 69.53,92.77 69.53,88.9 SV4.20
P221
  Top 0.305: IC3.14 75.25,94.4 75.25,93.03 73.34,91.12 SV5.1
P222
  Top 0.305: IC3.13 74.61,93.9 74.61,93.34 72.07,90.81 72.07,88.9 SV5.2
P223
  Top 0.305: IC3.19 78.11,97.19 78.11,93.98 75.88,91.76 SV5.3
P224
  Top 0.305: IC3.15 75.88,94.89 75.88,92.71 74.61,91.44 74.61,88.9 SV5.4
P225  (via drill 0.3 pad 0.61)
  Top 0.305: v80.01,98.11 79.45,98.11 | IC3.21 79.45,98.11 | 79.45,98.11 79.45,93.43 78.42,92.39 SV5.5